# Altium project Arduino-switcher-4channel.PrjPcb
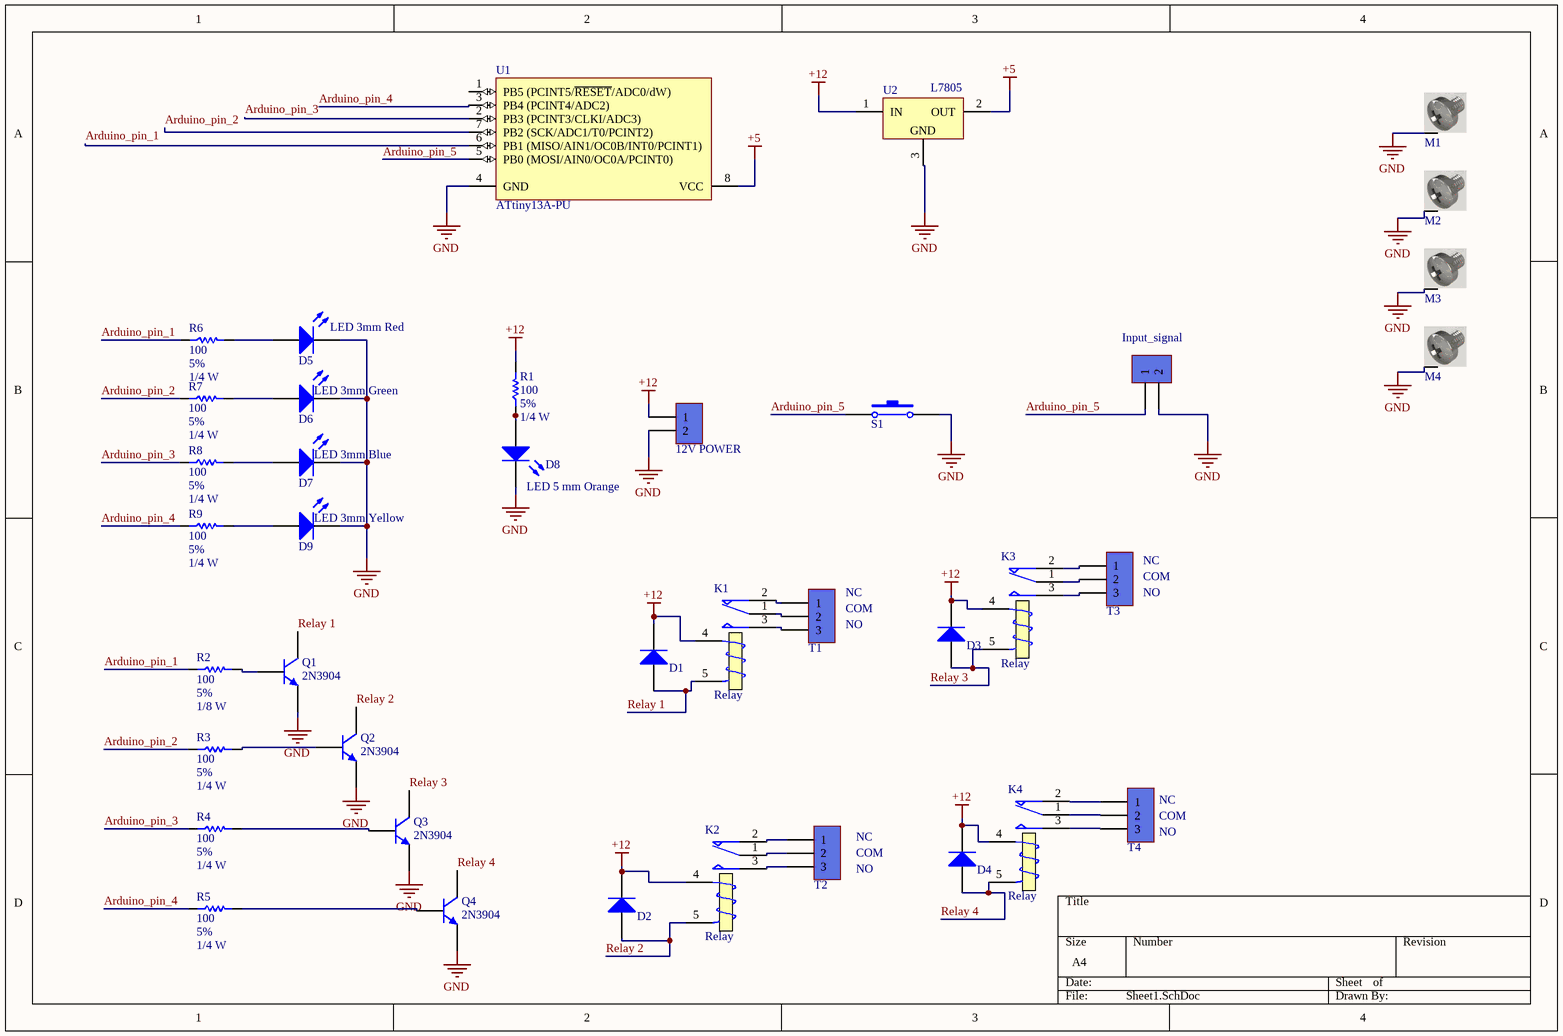
[diagram p0: Sheet1.SchDoc]
1 sheet, 39 parts. Net scope: global (net labels, ports and power ports of the same name join across sheets).
Board files: PCB1.PcbDoc, PCB2.PcbDoc

## Sheet Sheet1.SchDoc
size A4; DocumentNumber: 1; SheetNumber: 1; SheetTotal: 1

### Parts
12V_POWER  Terminal  [Terminal 1*2]  (value not drawn)
D1  Diode 1N4007 vertical  [D 50mm]  (value not drawn)
D2  Diode 1N4007 vertical  [D 50mm]  (value not drawn)
D3  Diode 1N4007 vertical  [D 50mm]  (value not drawn)
D4  Diode 1N4007 vertical  [D 50mm]  (value not drawn)
D5  LED 3mm Red  [LED-3mm]
D6  LED 3mm Green  [LED-3mm]
D7  LED 3mm Blue  [LED-3mm]
D8  LED 5 mm Orange  [LED-3mm]
D9  LED 3mm Yellow  [LED-3mm]
Input_signal  Terminal  [Terminal 1*2]  (value not drawn)
K1  Relay  [Relay 15.40x12.10x13.10]
K2  Relay  [Relay 15.40x12.10x13.10]
K3  Relay  [Relay 15.40x12.10x13.10]
K4  Relay  [Relay 15.40x12.10x13.10]
M1  Screw  [Board Screw]  (value not drawn)
M2  Screw  [Board Screw]  (value not drawn)
M3  Screw  [Board Screw]  (value not drawn)
M4  Screw  [Board Screw]  (value not drawn)
Q1  2N3904  [2N3904 TO92]
Q2  2N3904  [2N3904 TO92]
Q3  2N3904  [2N3904 TO92]
Q4  2N3904  [2N3904 TO92]
R1  Tolerance: 5%  Power: 1/4 W  [Res-(1/4)]  (hidden comment: 100)
R2  Tolerance: 5%  Power: 1/8 W  [Res-(1/4)]  (hidden comment: 100)
R3  Tolerance: 5%  Power: 1/4 W  [Res-(1/4)]  (hidden comment: 100)
R4  Tolerance: 5%  Power: 1/4 W  [Res-(1/4)]  (hidden comment: 100)
R5  Tolerance: 5%  Power: 1/4 W  [Res-(1/4)]  (hidden comment: 100)
R6  Tolerance: 5%  Power: 1/4 W  [Res-(1/4)]  (hidden comment: 100)
R7  Tolerance: 5%  Power: 1/4 W  [Res-(1/4)]  (hidden comment: 100)
R8  Tolerance: 5%  Power: 1/4 W  [Res-(1/4)]  (hidden comment: 100)
R9  Tolerance: 5%  Power: 1/4 W  [Res-(1/4)]  (hidden comment: 100)
S1  PB-2pin  [PB-2pin]  (value not drawn)
T1  Terminal  [Terminal 1*3]  (value not drawn)
T2  Terminal  [Terminal 1*3]  (value not drawn)
T3  Terminal  [Terminal 1*3]  (value not drawn)
T4  Terminal  [Terminal 1*3]  (value not drawn)
U1  ATtiny13A-PU  [ATtiny13A-PU 8P3]
U2  L7805  [78XXCV - Right]

### Nets
+5: U1.8(VCC) U2.2(OUT)
+12: 12V_POWER.1 D1.2(K) D2.2(K) D3.2(K) D4.2(K) K1.4(T1) K2.4(T1) K3.4(T1) K4.4(T1) R1.2 U2.1(IN)
GND: 12V_POWER.2 D5.2(K) D6.2(K) D7.2(K) D8.2(K) D9.2(K) Input_signal.2 M1.S M2.S M3.S M4.S Q1.1(E) Q2.1(E) Q3.1(E) Q4.1(E) S1.2 U1.4(GND) U2.3(GND)
Arduino_pin_1: R2.1 R6.1 U1.6(PB1_(MISO/AIN1/OC0B/INT0/PCINT1))
Arduino_pin_2: R3.1 R7.1 U1.7(PB2_(SCK/ADC1/T0/PCINT2))
Arduino_pin_3: R4.1 R8.1 U1.2(PB3_(PCINT3/CLKI/ADC3))
Arduino_pin_4: R5.1 R9.1 U1.3(PB4_(PCINT4/ADC2))
Arduino_pin_5: Input_signal.1 S1.1 U1.5(PB0_(MOSI/AIN0/OC0A/PCINT0))
Relay 1: D1.1(A) K1.5(T2) Q1.3(C)
Relay 2: D2.1(A) K2.5(T2) Q2.3(C)
Relay 3: D3.1(A) K3.5(T2) Q3.3(C)
Relay 4: D4.1(A) K4.5(T2) Q4.3(C)
NetD5_1: D5.1(A) R6.2
NetD6_1: D6.1(A) R7.2
NetD7_1: D7.1(A) R8.2
NetD8_1: D8.1(A) R1.1
NetD9_1: D9.1(A) R9.2
NetK1_1: K1.1(COM) T1.2
NetK1_2: K1.2(NC) T1.1
NetK1_3: K1.3(NO) T1.3
NetK2_1: K2.1(COM) T2.2
NetK2_2: K2.2(NC) T2.1
NetK2_3: K2.3(NO) T2.3
NetK3_1: K3.1(COM) T3.2
NetK3_2: K3.2(NC) T3.1
NetK3_3: K3.3(NO) T3.3
NetK4_1: K4.1(COM) T4.2
NetK4_2: K4.2(NC) T4.1
NetK4_3: K4.3(NO) T4.3
NetQ1_2: Q1.2(B) R2.2
NetQ2_2: Q2.2(B) R3.2
NetQ3_2: Q3.2(B) R4.2
NetQ4_2: Q4.2(B) R5.2

Not connected (* = marked no-connect by the designer): U1 1(PB5_(PCINT5/~{RESET}/ADC0/dW))

### Notes on the sheet
- (near T3) NC
- (near T3) COM
- (near T1) NC
- (near T1) COM
- (near T1) NO
- (near T3) NO
- (near T2) NC
- (near T2) COM
- (near T4) NC
- (near T4) COM
- (near T4) NO
- (near T2) NO

### Library data of the parts
12V_POWER Input_signal = Terminal 1*2: Terminal 2 Pin 250VAC 16A; Designer: Seyed Mohsen Ghasemain; E-mail: picpars@gmail.com; ComponentLinkURL: www.picpars.com
D1-D4 = Diode 1N4007 vertical: 1 Amp General Purpose Rectifier; Publisher: seyed mohsen ghasemian
D5-D9 = LED 3mm: Typical LED; Designer: Seyed Mohsen Ghasemian; Published: 02/04/2012; PackageReference: LED; Publisher: www.picpars.com; PackageDescription: LED; 2 Leads
K1-K4 = Relay: SPDT Relay; Designer: Eng. Saeid Jorablo; Company: E.P.I.L; Design_Date: 2011/10/31
M1-M4 = Board Screw: Board Screw With Spacer
Q1-Q4 = 2N3904: npn; Manufacturer: ONSemiconductor; Emitter- Base Voltage VEBO: 6V; Maximum Power Dissipation: 625mW; Maximum DC Collector Current: 0.2A; Collector- Emitter Voltage VCEO Max: 40V; Collector- Base Voltage VCBO: 60V; DC Collector/Base Gain hfe Min: 60; Configuration: Single; Collector-Emitter Saturation Voltage: 0.3V; Gain Bandwidth Product fT: 270MHz; Mounting Style: ThroughHole; Package / Case: TO-92-3(TO-226); Mounting Technology: ThroughHole; Minimum Operating Temperature: -65C; Datasheet Version: Rev. 8, 08/2012; Product Category: BipolarTransistors-BJT; Factory Pack Quantity: 5000; Transistor Polarity: NPN; Package Description: 3-Pin Transistor Outline, Body 4.825 x 3.685 mm, Pitch 1.27 mm; RoHS: Details; Datasheet URL: https://datasheet.ciiva.com/4725/2n3903-d-285841-4725808.pdf; Packaging: Bulk; Maximum Operating Temperature: +150C; Package Reference: TO-92-3-29-11; Brand: ONSemiconductor; Manufacturer URL: http://www.onsemi.com/
R1-R9 = Resistor: Value: 100
S1 = PB-2pin: Switch; E-mail: picpars@gmail.com; Designer: Seyed Mohsen Ghasemian; Publisher: www.picpars.com; WEB: www.picpars.com
T1-T4 = Terminal 1*3: Terminal 3 Pin 250VAC 16A; Designer: Seyed Mohsen Ghasemain; E-mail: picpars@gmail.com; ComponentLinkURL: www.picpars.com
U2 = L78XXCV: Fixed Voltage Regulator; Designer: Saeid Jorablo; Company: ControTec; Adding Date: 1387/01/06; Voltage: *